# EAGLE schematic Filter + Rectifier + ADC (EAGLE 9.6.2)
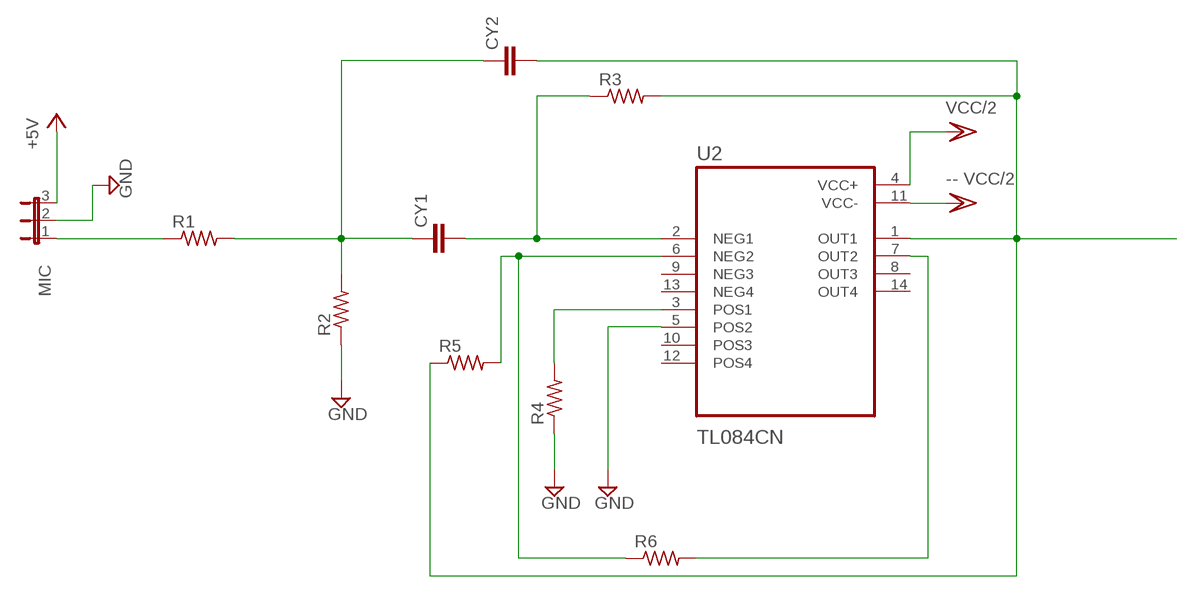
[diagram p0: schematic, sheet 1]

## Parts
CY1  CYYC7B5  [YC7B5]
CY2  CYYC7B5  [YC7B5]
MIC  JP2W  [JP2W]
R1  R-US_0204/7  [0204/7]
R2  R-US_0204/7  [0204/7]
R3  R-US_0204/7  [0204/7]
R4  R-US_0204/7  [0204/7]
R5  R-US_0204/7  [0204/7]
R6  R-US_0204/7  [0204/7]
U2  TL084CN  [DIP794W45P254L1969H508Q14]

## Nets
+5V: MIC.3
GND: MIC.2 R2.1 R4.1 U2.5(POS2)
N$8: CY2.2 R3.2 R5.1 U2.1(OUT1)
N$9: R6.2 U2.7(OUT2)
N$10: MIC.1 R1.1
N$11: CY1.1 CY2.1 R1.2 R2.2
N$12: CY1.2 R3.1 U2.2(NEG1)
N$13: R4.2 U2.3(POS1)
N$16: R5.2 R6.1 U2.6(NEG2)
VCC/2: U2.4(VCC+) U2.11(VCC-) ; supply symbol labelled -- VCC/2
Unconnected: U2.8(OUT3) U2.9(NEG3) U2.10(POS3) U2.12(POS4) U2.13(NEG4) U2.14(OUT4)

## Library data of the parts
CY1 CY2 = rcl:CY: Y CAPACITOR for power line; SPICEPREFIX: C
MIC = jumper:JP2W: JUMPER
R1-R6 = rcl:R-US_: RESISTOR, American symbol; SPICEPREFIX: R
U2 = TL084CN:TL084CN; DESCRIPTION: Quad High Slew Rate JFET-Input Operational Amplifier 14-PDIP 0 to 70; DIGI-KEY_PART_NUMBER: 296-1784-5-ND; MF: Texas Instruments; MP: TL084CN; PACKAGE: PDIP-14 Texas Instruments; PURCHASE-URL: https://pricing.snapeda.com/search/part/TL084CN/?ref=eda